# EAGLE design aaLogger (EAGLE 6.4)
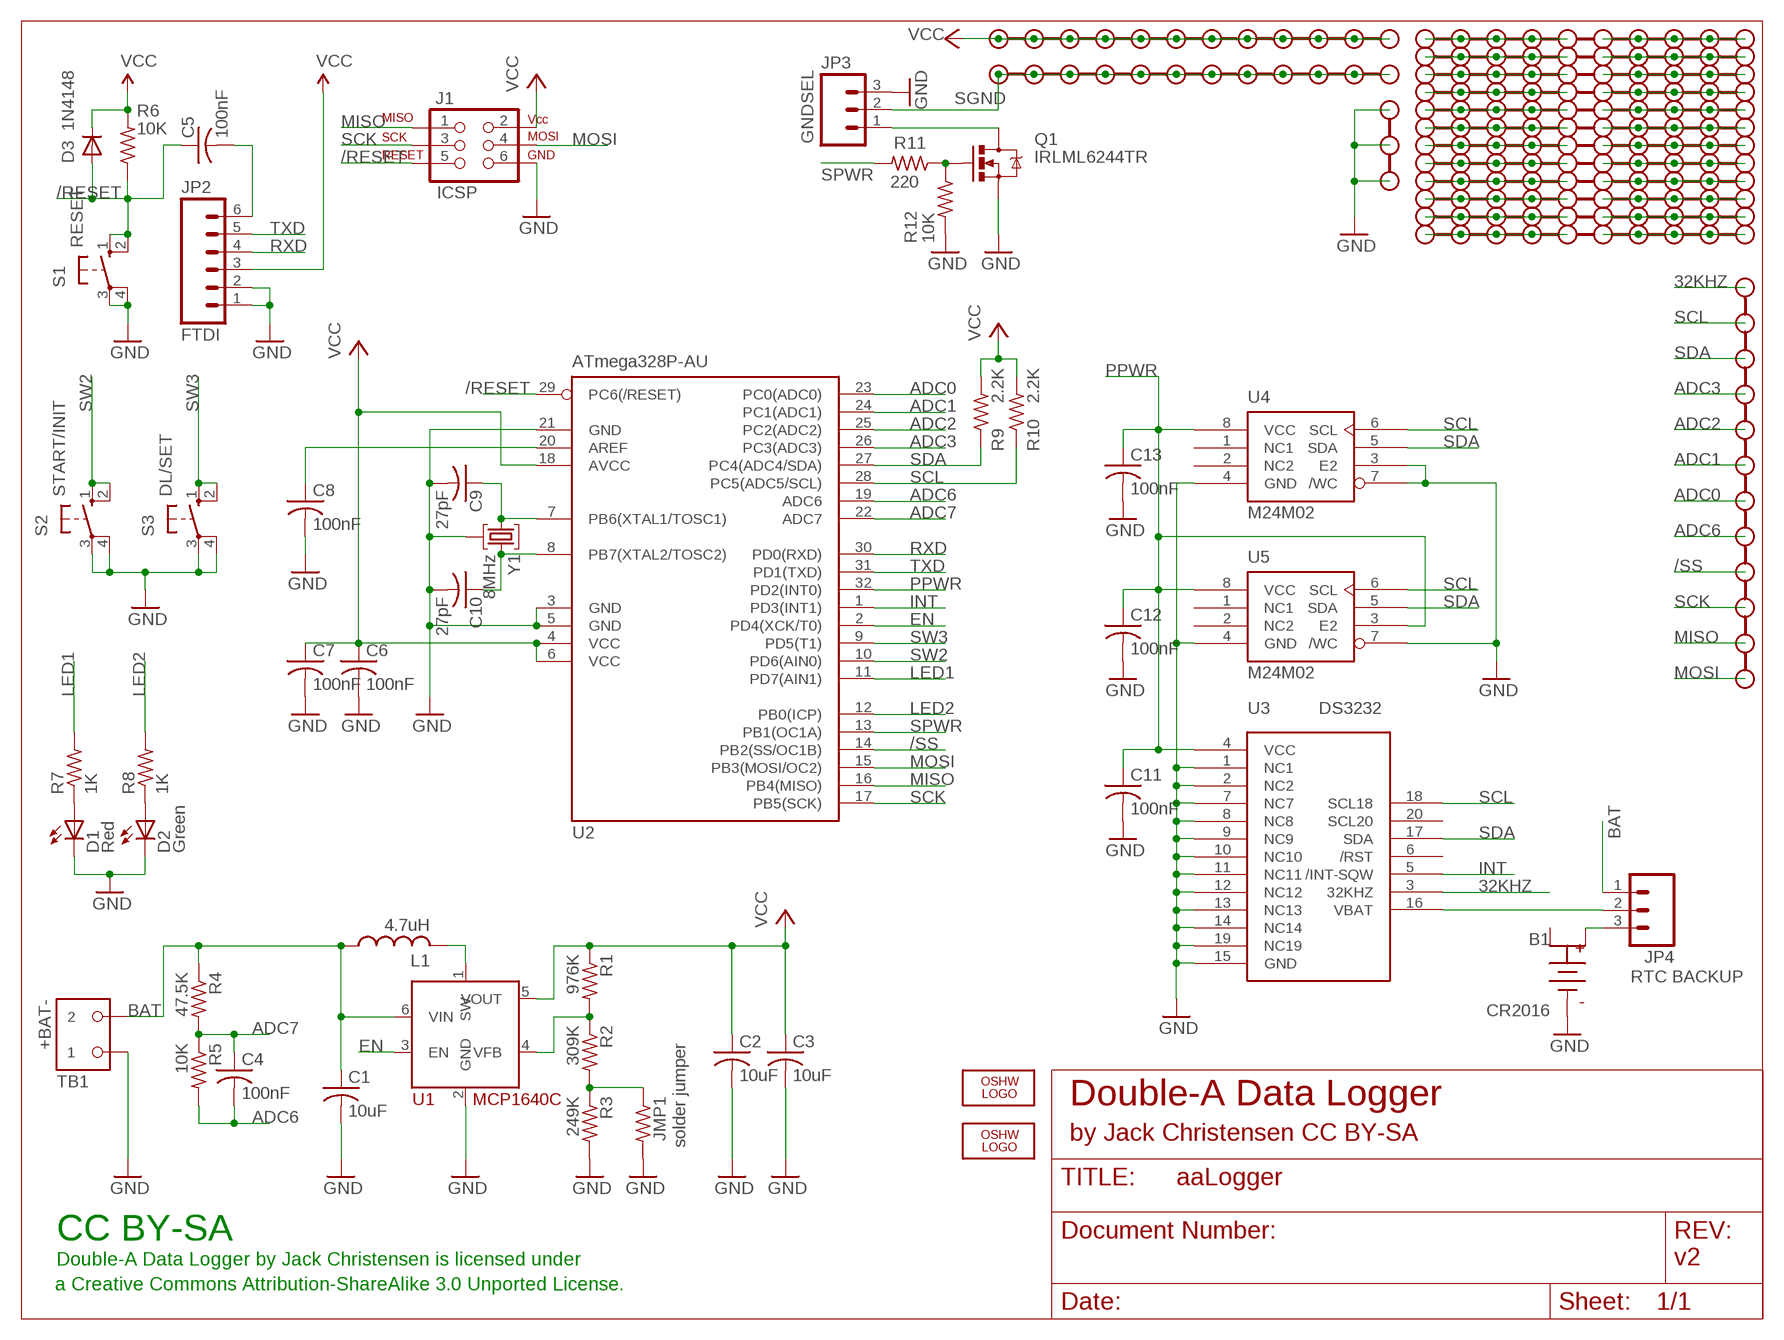
[diagram p0: schematic, sheet 1]

## Parts
B1  CR2016  COIN-CELL-2016-SMT  [BAT-HLD-002-SMT]
C1  10uF  C-USM0805  [M0805]
C2  10uF  C-USM0805  [M0805]
C3  10uF  C-USM0805  [M0805]
C4  100nF  C-USM0805  [M0805]
C5  100nF  C-USM0805  [M0805]
C6  100nF  C-USM0805  [M0805]
C7  100nF  C-USM0805  [M0805]
C8  100nF  C-USM0805  [M0805]
C9  27pF  C-USM0805  [M0805]
C10  27pF  C-USM0805  [M0805]
C11  100nF  C-USM0805  [M0805]
C12  100nF  C-USM0805  [M0805]
C13  100nF  C-USM0805  [M0805]
D1  Red  LEDCHIPLED_1206  [CHIPLED_1206]
D2  Green  LEDCHIPLED_1206  [CHIPLED_1206]
D3  1N4148  DIODESOD-323F  [SOD-323F]
J1  ICSP  AVR_SPI_PRG_62X3_LOCK  [2X3_LOCK]
JMP1  solder jumper  R-US_M0805  [M0805]
JP1  PROTO-12NR  [PROTO-12-NR]
JP2  FTDI  M06LOCK  [1X06_LOCK]
JP3  GNDSEL  M03LOCK  [1X03_LOCK]
JP4  RTC BACKUP  M03LOCK  [1X03_LOCK]
L1  4.7uH  INDUCTORNRS5020  [NRS5020]
LOGO1  OSHW_LOGO_8MILX0150-NT  [OSHW_8X150_NOTEXT]
LOGO2  OSHW_LOGO_8MILX0150-NT  [OSHW_8X150_NOTEXT]
PR1  PROTO-10  [PROTO-10]
PR2  PROTO-10  [PROTO-10]
PR3  PROTO-10  [PROTO-10]
PR4  PROTO-10  [PROTO-10]
PR5  PROTO-10  [PROTO-10]
PR6  PROTO-10  [PROTO-10]
PR7  PROTO-10  [PROTO-10]
PR8  PROTO-10  [PROTO-10]
PR9  PROTO-10  [PROTO-10]
PR10  PROTO-10  [PROTO-10]
PR11  PROTO-10  [PROTO-10]
PR12  PROTO-10  [PROTO-10]
PR13  PROTO-3  [PROTO-3]
Q1  IRLML6244TR  MOSFET-NCHANNELSOT23  [SOT23]
R1  976K  R-US_M0805  [M0805]
R2  309K  R-US_M0805  [M0805]
R3  249K  R-US_M0805  [M0805]
R4  47.5K  R-US_M0805  [M0805]
R5  10K  R-US_M0805  [M0805]
R6  10K  R-US_M0805  [M0805]
R7  1K  R-US_M0805  [M0805]
R8  1K  R-US_M0805  [M0805]
R9  2.2K  R-US_M0805  [M0805]
R10  2.2K  R-US_M0805  [M0805]
R11  220  R-US_M0805  [M0805]
R12  10K  R-US_M0805  [M0805]
S1  RESET  10-XXOCT  [B3F-10XXOCT]
S2  START/INIT  10-XXOCT  [B3F-10XXOCT]
S3  DL/SET  10-XXOCT  [B3F-10XXOCT]
TB1  +BAT-  OST-TB-23.5MM  [OST-TB-2-3.5MM]
U1  MCP1640C  MCP1640  [SOT23-6]
U2  ATmega328P-AU  MEGA8-AI  [TQFP32-08]
U3  DS3232  [SO20W]
U4  M24M02  [SO08]
U5  M24M02  [SO08]
U$1  PROTO-12PROTO  [PROTO-12]
U$2  PROTO-12PROTO  [PROTO-12]
Y1  8MHz  RESONATOR  [RESONATOR]

## Nets
32KHZ: JP1.1 U3.3(32KHZ)
/RESET: C5.1 D3.A J1.5 R6.1 S1.1(S) S1.2(S1) U2.29(PC6(/RESET))
/SS: JP1.9 U2.14(PB2(SS/OC1B))
ADC0: JP1.7 U2.23(PC0(ADC0))
ADC1: JP1.6 U2.24(PC1(ADC1))
ADC2: JP1.5 U2.25(PC2(ADC2))
ADC3: JP1.4 U2.26(PC3(ADC3))
ADC6: C4.2 JP1.8 R5.2 U2.19(ADC6)
ADC7: C4.1 R4.2 R5.1 U2.22(ADC7)
BAT: C1.1 JP4.1 L1.P$1 R4.1 TB1.P$2 U1.6(VIN)
EN: U1.3(EN) U2.2(PD4(XCK/T0))
GND: B1.NEG(B-) C1.2 C2.2 C3.2 C6.2 C7.2 C8.2 C9.2 C10.2 C11.2 C12.2 C13.2 D1.C D2.C J1.6 JMP1.2 JP2.1 JP2.2 JP3.3 PR13.1 PR13.2 PR13.3 Q1.2(S) R3.2 R12.2 S1.3(P) S1.4(P1) S2.3(P) S2.4(P1) S3.3(P) S3.4(P1) TB1.P$1 U1.2(GND) U2.3(GND) U2.5(GND) U2.21(GND) U3.1(NC1) U3.2(NC2) U3.7(NC7) U3.8(NC8) U3.9(NC9) U3.10(NC10) U3.11(NC11) U3.12(NC12) U3.13(NC13) U3.14(NC14) U3.15(GND) U3.19(NC19) U4.3(E2) U4.4(GND) U4.7(/WC) U5.4(GND) U5.7(/WC) Y1.2
INT: U2.1(PD3(INT1)) U3.5(/INT-SQW)
LED1: R7.2 U2.11(PD7(AIN1))
LED2: R8.2 U2.12(PB0(ICP))
MISO: J1.1 JP1.11 U2.16(PB4(MISO))
MOSI: J1.4 JP1.12 U2.15(PB3(MOSI/OC2))
N$1: B1.POS1 JP4.3
N$2: D1.A R7.1
N$3: D2.A R8.1
N$4: PR1.6 PR1.7 PR1.8 PR1.9 PR1.10
N$5: PR5.6 PR5.7 PR5.8 PR5.9 PR5.10
N$6: R1.2 R2.1 U1.4(VFB)
N$7: L1.P$2 U1.1(SW)
N$8: C9.1 U2.7(PB6(XTAL1/TOSC1)) Y1.1
N$9: PR2.6 PR2.7 PR2.8 PR2.9 PR2.10
N$10: PR3.6 PR3.7 PR3.8 PR3.9 PR3.10
N$11: C10.1 U2.8(PB7(XTAL2/TOSC2)) Y1.3
N$12: JMP1.1 R2.2 R3.1
N$13: C8.1 U2.20(AREF)
N$14: PR4.6 PR4.7 PR4.8 PR4.9 PR4.10
N$15: PR6.6 PR6.7 PR6.8 PR6.9 PR6.10
N$16: PR7.1 PR7.2 PR7.3 PR7.4 PR7.5
N$17: PR8.1 PR8.2 PR8.3 PR8.4 PR8.5
N$18: PR9.1 PR9.2 PR9.3 PR9.4 PR9.5
N$19: PR10.1 PR10.2 PR10.3 PR10.4 PR10.5
N$20: PR11.1 PR11.2 PR11.3 PR11.4 PR11.5
N$21: PR12.1 PR12.2 PR12.3 PR12.4 PR12.5
N$22: PR1.1 PR1.2 PR1.3 PR1.4 PR1.5
N$23: PR2.1 PR2.2 PR2.3 PR2.4 PR2.5
N$24: Q1.1(G) R11.1 R12.1
N$25: PR3.1 PR3.2 PR3.3 PR3.4 PR3.5
N$26: PR4.1 PR4.2 PR4.3 PR4.4 PR4.5
N$27: PR6.1 PR6.2 PR6.3 PR6.4 PR6.5
N$28: PR7.6 PR7.7 PR7.8 PR7.9 PR7.10
N$29: PR5.1 PR5.2 PR5.3 PR5.4 PR5.5
N$30: PR8.6 PR8.7 PR8.8 PR8.9 PR8.10
N$31: PR9.6 PR9.7 PR9.8 PR9.9 PR9.10
N$32: PR10.6 PR10.7 PR10.8 PR10.9 PR10.10
N$33: PR11.6 PR11.7 PR11.8 PR11.9 PR11.10
N$34: PR12.6 PR12.7 PR12.8 PR12.9 PR12.10
N$35: JP4.2 U3.16(VBAT)
N$36: JP3.1 Q1.3(D)
PPWR: C11.1 C12.1 C13.1 U2.32(PD2(INT0)) U3.4(VCC) U4.8(VCC) U5.3(E2) U5.8(VCC)
RST: C5.2 JP2.6
RXD: JP2.4 U2.30(PD0(RXD))
SCK: J1.3 JP1.10 U2.17(PB5(SCK))
SCL: JP1.2 R10.1 U2.28(PC5(ADC5/SCL)) U3.18(SCL18) U4.6(SCL) U5.6(SCL)
SDA: JP1.3 R9.1 U2.27(PC4(ADC4/SDA)) U3.17(SDA) U4.5(SDA) U5.5(SDA)
SGND: JP3.2 U$2.1 U$2.2 U$2.3 U$2.4 U$2.5 U$2.6 U$2.7 U$2.8 U$2.9 U$2.10 U$2.11 U$2.12
SPWR: R11.2 U2.13(PB1(OC1A))
SW2: S2.1(S) S2.2(S1) U2.10(PD6(AIN0))
SW3: S3.1(S) S3.2(S1) U2.9(PD5(T1))
TXD: JP2.5 U2.31(PD1(TXD))
VCC: C2.1 C3.1 C6.1 C7.1 D3.K J1.2 JP2.3 R1.1 R6.2 R9.2 R10.2 U1.5(VOUT) U2.4(VCC) U2.6(VCC) U2.18(AVCC) U$1.1 U$1.2 U$1.3 U$1.4 U$1.5 U$1.6 U$1.7 U$1.8 U$1.9 U$1.10 U$1.11 U$1.12
Unconnected: B1.POS2 U3.6(/RST) U3.20(SCL20) U4.1(NC1) U4.2(NC2) U5.1(NC1) U5.2(NC2)

## Notes on the sheet
- Double-A Data Logger
- by Jack Christensen CC BY-SA
- CC BY-SA
- Double-A Data Logger by Jack Christensen is licensed under | v2
- a Creative Commons Attribution-ShareAlike 3.0 Unported License.

## Library data of the parts
B1 = _jc:COIN-CELL
C1-C13 = _jc:C-US: CAPACITOR, American symbol
D1 D2 = adafruit:LED: LED OSRAM: - CHIPLED LG R971, LG N971, LY N971, LG Q971, LY Q971, LO R971, LY R971 LH N974, LH R974 LS Q976, LO Q976, LY Q976 LO Q996 - Hyper CHIPLED LW Q18S LB Q993, LB Q99A, LB R99A - SideLED LS A670, LO A670, LY A670, LG A670, LP A670 LB A673, LV A673, LT A673, LW A673 LH A674 LY A675 LS A676, LA A676, LO A676, LY A676, LW A676 LS A679, LY A679, LG A679 - Hyper Micro SIDELED® LS Y876, LA Y876, LO Y876, LY Y876 LT Y87S - SmartLED LW L88C, LW L88S LB L89C, LB L89S, LG L890 LS L89K, LO L89K, LY L89K LS L896, LA L896, LO L896, LY L896 - TOPLED LS T670, LO T670, LY T670, LG T670, LP T670 LSG T670, LSP T670, LSY T670, LOP T670, LYG T670 LG T671, LOG T671, LSG T671 LB T673, LV T673, LT T673, LW T673 LH T674 LS T676, LA T676, LO T676, LY T676, LB T676, LH T676, LSB T676, LW T676 LB T67C, LV T67C, LT T67C, LS T67K, LO T67K, LY T67K, LW E67C LS E67B, LA E67B, LO E67B, LY E67B, LB E67C, LV E67C, LT E67C LW T67C LS T679, LY T679, LG T679 LS T770, LO T770, LY T770, LG T770, LP T770 LB T773, LV T773, LT T773, LW T773 LH T774 LS E675, LA E675, LY E675, LS T675 LS T776, LA T776, LO T776, LY T776, LB T776 LHGB T686 LT T68C, LB T68C - Hyper Mini TOPLED® LB M676 - Mini TOPLED Santana® LG M470 LS M47K, LO M47K, LY M47K Source: http://www.osram.convergy.de/
D3 = _jc:DIODE
J1 = _jc:AVR_SPI_PRG_6: AVR ISP 6 Pin This is the reduced ISP connector for AVR programming. Common on Arduino. This footprint will take up less PCB space and can be used with a 10-pin to 6-pin adapter such as SKU: BOB-08508
JMP1 R1-R12 = _jc:R-US_: RESISTOR, American symbol
JP1 U$1 U$2 = _jc:PROTO-12
JP2 = SparkFun:M06: Header 6 Standard 6-pin 0.1" header. Use with straight break away headers (SKU : PRT-00116), right angle break away headers (PRT-00553), swiss pins (PRT-00743), machine pins (PRT-00117), and female headers (PRT-00115). Molex polarized connector foot print use with SKU : PRT-08094 with associated crimp pins and housings. NOTES ON THE VARIANTS LOCK and LOCK_LONGPADS... This footprint was designed to help hold the alignment of a through-hole component (i.e. 6-pin header) while soldering it into place. You may notice that each hole has been shifted either up or down by 0.005 of an inch from it's more standard position (which is a perfectly straight line). This slight alteration caused the pins (the squares in the middle) to touch the edges of the holes. Because they are alternating, it causes a "brace" to hold the component in place. 0.005 has proven to be the perfect amount of "off-center" position when using our standard breakaway headers. Although looks a little odd when you look at the bare footprint, once you have a header in there, the alteration is very hard to notice. Also, if you push a header all the way into place, it is covered up entirely on the bottom side. This idea of altering the position of holes to aid alignment will be further integrated into the Sparkfun Library for other footprints. It can help hold any component with 3 or more connection pins.
JP3 JP4 = SparkFun:M03: Header 3 Standard 3-pin 0.1" header. Use with straight break away headers (SKU : PRT-00116), right angle break away headers (PRT-00553), swiss pins (PRT-00743), machine pins (PRT-00117), and female headers (PRT-00115). Molex polarized connector foot print use with SKU : PRT-08232 with associated crimp pins and housings.
L1 = _jc:INDUCTOR: Murata #11R472C
LOGO1 LOGO2 = ohw-logo:OSHW_LOGO_8MIL
PR1-PR12 = _jc:PROTO-10
PR13 = _jc:PROTO-3
Q1 = _jc:MOSFET-NCHANNEL
S1-S3 = _jc:10-XX: OMRON SWITCH
TB1 = _jc:OST-TB-2
U1 = _jc:MCP1640
U2 = atmel:MEGA8: MICROCONTROLLER 8 Kbytes FLASH, 1 kbytes SRAM, 512 bytes EEPROM, USART, 6-channel 10 bit ADC, 2-channel 8 bit ADC Pin compatible with Atmega48, ATMega88, ATMega168 Source: avr.lbr; MPN: ATMEGA8-16AU; OC_FARNELL: 9171371; OC_NEWARK: 73M8863
U3 = _jc:DS3232
U4 U5 = _jc:M24M02
Y1 = _jc:RESONATOR: Ceramic resonator with capacitors or HC49/US crystal

## Board
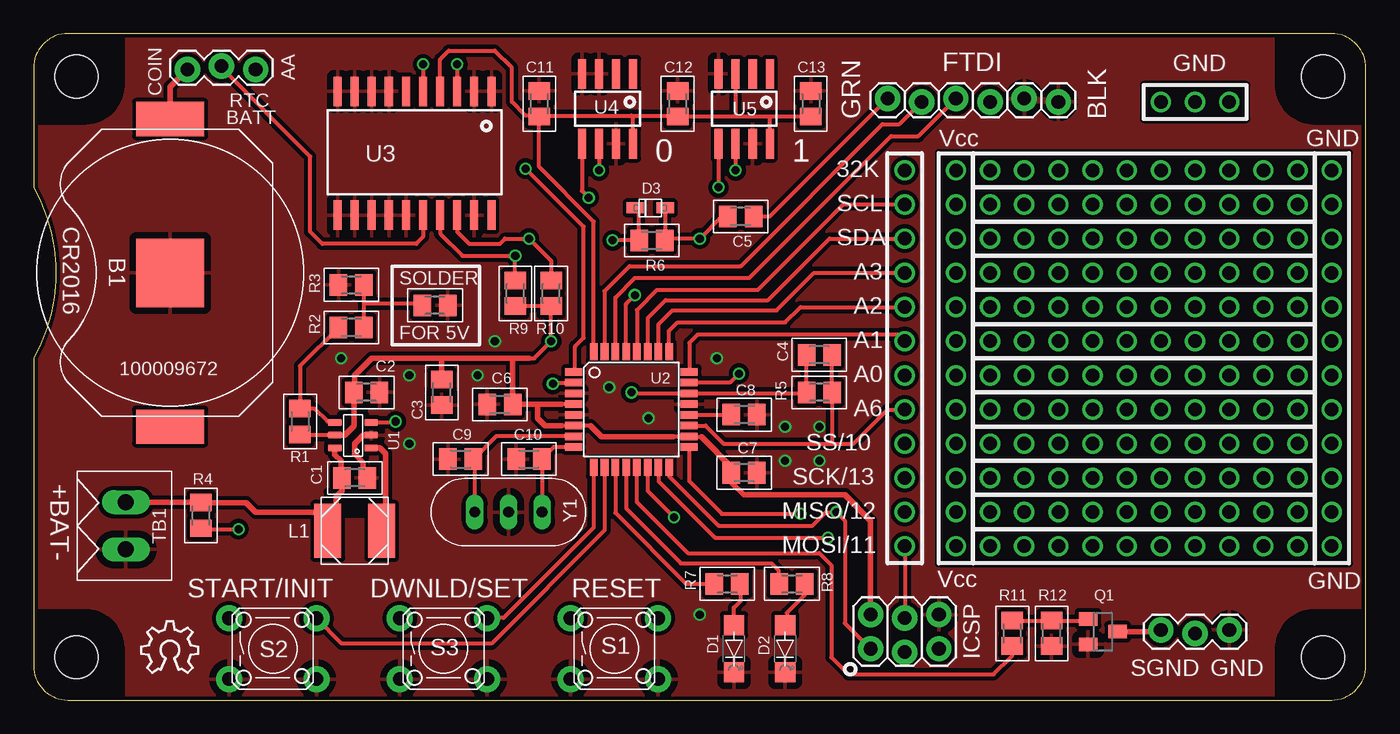
[diagram p1: board, top side]
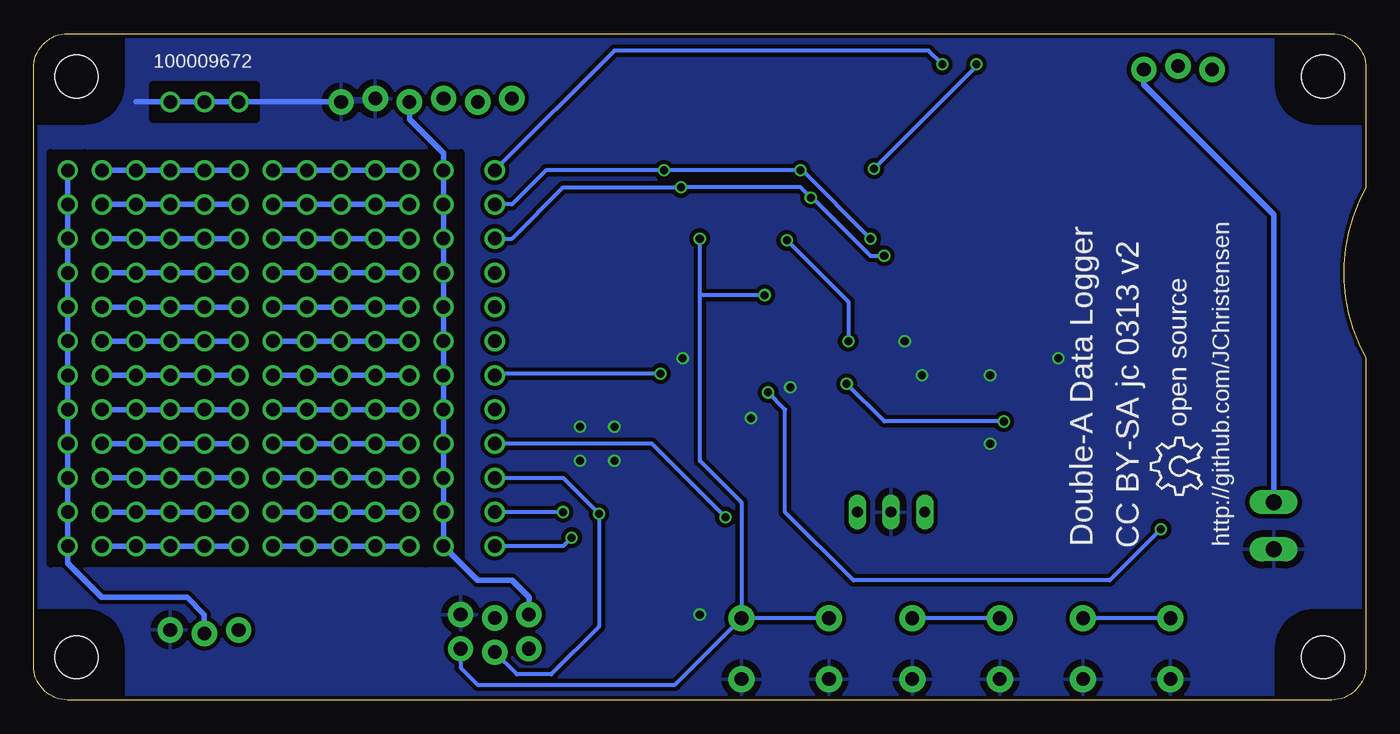
[diagram p2: board, bottom side, seen from below]

Size 99.06 x 49.53 mm. Coordinates in mm from the lower left corner, seen from the top.
Outline: 0,46.99 0,38.1 arc-58 0,25.4 0,2.54 arc90 2.54,0 96.52,0 arc90 99.06,2.54 99.06,46.99 arc90 96.52,49.53 2.54,49.53 arc90 0,46.99
Copper layers (1*16): Top 0.035mm / dielectric 1.5mm / Bottom 0.035mm
Design rules "ITead_rule_jc *": minimum track width 10mil, minimum drill 12mil, track to track 10mil, track to pad 9mil, pad to pad 9mil, via to via 10mil, smd to smd 0mil, copper to edge 10mil, drill to drill 10mil, minimum pad ring 10mil, minimum via ring 6mil, stop-mask expansion 2mil, vias tented up to drill 100mil, thermal gap 20mil
Holes 3.2 mm at 3.17,46.35 3.17,3.17 95.89,46.35 95.89,3.17
tRestrict: area 0,43.2 to 6.3,49.5; area 92.7,43.2 to 99.1,49.5; area 0,0 to 6.3,6.3; area 92.7,0 to 99.1,6.3; area 21.8,13.8 to 25.7,15.5; area 22.9,17.3 to 24.6,21.2
bRestrict: area 0,0 to 6.3,6.3; area 92.7,0 to 99.1,6.3; area 92.7,43.2 to 99.1,49.5; area 0,43.2 to 6.3,49.5

### Footprints (pad centres in the part's own frame; a part is rotated, then mirrored left to right if it is on the bottom)
BAT-HLD-002-SMT = smd 5.08 x 5.08: NEG 0,0 | smd 2.54 x 5.08: POS1 -11.43,0; POS2 11.43,0
M0805 = smd 1.3 x 1.6: 1 -0.95,0; 2 0.95,0
CHIPLED_1206 = smd 1.5 x 1.5: A 0,-1.75; C 0,1.75
SOD-323F = smd 1.27 x 0.813: A -1.118,0; K 1.118,0
2X3_LOCK = drill 1.016 pad 1.88: 1 0,0; 2 0,2.54; 3 2.54,-0.254; 4 2.54,2.286; 5 5.08,0; 6 5.08,2.54
PROTO-12-NR = drill 1: 1 -13.97,0; 2 -11.43,0; 3 -8.89,0; 4 -6.35,0; 5 -3.81,0; 6 -1.27,0; 7 1.27,0; 8 3.81,0; 9 6.35,0; 10 8.89,0; 11 11.43,0; 12 13.97,0
1X06_LOCK = drill 1.016 pad 1.88: 1 0,0; 2 2.54,-0.254; 3 5.08,0; 4 7.62,-0.254; 5 10.16,0; 6 12.7,-0.254
1X03_LOCK = drill 1.016 pad 1.88: 1 0,0.127; 2 2.54,-0.127; 3 5.08,0.127
NRS5020 = smd 2 x 4: P$1 -2,0; P$2 2,0
PROTO-10 = drill 1: 1 -11.43,0; 2 -8.89,0; 3 -6.35,0; 4 -3.81,0; 5 -1.27,0; 6 1.27,0; 7 3.81,0; 8 6.35,0; 9 8.89,0; 10 11.43,0
PROTO-3 = drill 1: 1 -2.54,0; 2 0,0; 3 2.54,0
SOT23 = smd 1 x 1.4: 1 -0.95,-1.1; 2 0.95,-1.1; 3 0,1.1
B3F-10XXOCT = drill 1.016 pad 1.93: 1 -3.251,2.261; 2 3.251,2.261; 3 -3.251,-2.261; 4 3.251,-2.261
OST-TB-2-3.5MM = drill 1.2 long: P$1 1.75,0; P$2 -1.75,0
SOT23-6 = smd 0.508 x 1.016: 1 -0.95,-1.35; 2 0,-1.35; 3 0.95,-1.35; 4 0.95,1.35; 5 0,1.35; 6 -0.95,1.35
TQFP32-08 = smd 1.27 x 0.559: 1 -4.293,2.8; 2 -4.293,2; 3 -4.293,1.2; 4 -4.293,0.4; 5 -4.293,-0.4; 6 -4.293,-1.2; 7 -4.293,-2; 8 -4.293,-2.8; 17 4.293,-2.8; 18 4.293,-2; 19 4.293,-1.2; 20 4.293,-0.4; 21 4.293,0.4; 22 4.293,1.2; 23 4.293,2; 24 4.293,2.8 | smd 0.559 x 1.27: 9 -2.8,-4.293; 10 -2,-4.293; 11 -1.2,-4.293; 12 -0.4,-4.293; 13 0.4,-4.293; 14 1.2,-4.293; 15 2,-4.293; 16 2.8,-4.293; 25 2.8,4.293; 26 2,4.293; 27 1.2,4.293; 28 0.4,4.293; 29 -0.4,4.293; 30 -1.2,4.293; 31 -2,4.293; 32 -2.8,4.293
SO20W = smd 0.6 x 2.2: 1 -5.715,-4.6; 2 -4.445,-4.6; 3 -3.175,-4.6; 4 -1.905,-4.6; 5 -0.635,-4.6; 6 0.635,-4.6; 7 1.905,-4.6; 8 3.175,-4.6; 9 4.445,-4.6; 10 5.715,-4.6; 11 5.715,4.6; 12 4.445,4.6; 13 3.175,4.6; 14 1.905,4.6; 15 0.635,4.6; 16 -0.635,4.6; 17 -1.905,4.6; 18 -3.175,4.6; 19 -4.445,4.6; 20 -5.715,4.6
SO08 = smd 0.6 x 2.2: 1 -1.905,-2.6; 2 -0.635,-2.6; 3 0.635,-2.6; 4 1.905,-2.6; 5 1.905,2.6; 6 0.635,2.6; 7 -0.635,2.6; 8 -1.905,2.6
PROTO-12 = drill 1: 1 -13.97,0; 2 -11.43,0; 3 -8.89,0; 4 -6.35,0; 5 -3.81,0; 6 -1.27,0; 7 1.27,0; 8 3.81,0; 9 6.35,0; 10 8.89,0; 11 11.43,0; 12 13.97,0
RESONATOR = drill 0.8 pad 1.27 long: 1 -2.5,0; 2 0,0; 3 2.5,0

### Placement (x,y rotation side)
B1  10.16,31.75 270 top
C1  23.88,16.51 0 top
C2  24.77,22.86 0 top
C3  30.35,22.86 270 top
C4  58.42,25.65 0 top
C5  52.58,35.94 0 top
C6  34.67,21.97 180 top
C7  52.83,16.89 0 top
C8  52.83,21.21 0 top
C9  31.75,17.91 180 top
C10  36.83,17.91 180 top
C11  37.59,44.32 90 top
C12  47.88,44.32 90 top
C13  57.78,44.32 90 top
D1  52.07,3.81 180 top
D2  55.88,3.81 180 top
D3  45.85,36.58 180 top
J1  62.23,3.81 0 top
JMP1  29.84,29.34 0 top
JP1  64.77,25.4 270 top
JP2  76.2,44.45 180 top
JP3  83.82,5.08 0 top
JP4  16.51,46.99 180 top
L1  23.88,12.57 0 top
LOGO1  8,2.03 0 top
LOGO2  12.19,15.24 90 bottom
PR1  82.55,39.37 0 top
PR2  82.55,36.83 0 top
PR3  82.55,34.29 0 top
PR4  82.55,31.75 0 top
PR5  82.55,29.21 0 top
PR6  82.55,26.67 0 top
PR7  82.55,24.13 0 top
PR8  82.55,21.59 0 top
PR9  82.55,19.05 0 top
PR10  82.55,16.51 0 top
PR11  82.55,13.97 0 top
PR12  82.55,11.43 0 top
PR13  86.36,44.45 0 top
Q1  79.5,5.08 270 top
R1  19.81,20.7 90 top
R2  23.62,27.69 0 top
R3  23.62,30.86 180 top
R4  12.45,13.72 270 top
R5  58.42,22.86 0 top
R6  45.97,34.16 180 top
R7  51.56,8.64 180 top
R8  56.39,8.64 180 top
R9  35.81,30.23 270 top
R10  38.48,30.23 270 top
R11  72.77,4.95 270 top
R12  75.69,4.95 270 top
S1  43.18,3.81 0 top
S2  17.78,3.81 0 top
S3  30.48,3.81 0 top
TB1  6.86,12.95 270 top
U1  23.75,19.68 90 top
U2  44.45,21.59 0 top
U3  28.32,40.64 180 top
U4  42.67,43.94 180 top
U5  52.83,43.94 180 top
U$1  68.58,25.4 270 top
U$2  96.52,25.4 270 top
Y1  35.31,13.97 0 top

### Tracks (layer width: path | path; a pad name or v marks a point on that pad's centre or on a via)
32KHZ  (via drill 0.6)
  Top 0.305: v31.5,47.24 U3.3
  Bottom 0.305: v31.5,47.24 32.51,48.26 55.88,48.26 JP1.1
/RESET  (via drill 0.6)
  Top 0.305: D3.A 46.97,34.3 R6.1 46.95,34.29 v49.53,34.29 51.18,35.94 C5.1 | v44.7,30.1 44.05,29.45 U2.29
  Bottom 0.305: S1.1 S1.2 | v44.7,30.1 49.53,30.1 | 49.53,30.1 v49.53,34.29 | 49.53,30.1 49.53,17.78 46.43,14.68 S1.2 | J1.5 67.31,2.41 66.04,1.14 51.36,1.14 S1.2
/SS  (via drill 0.6)
  Top 0.305: U2.14 45.65,15.56 v47.62,13.59
  Bottom 0.305: v47.62,13.59 53.09,19.05 JP1.9
ADC0  (via drill 0.6)
  Top 0.305: U2.23 48.77,23.62 51.82,23.62 v52.45,24.26
  Bottom 0.305: v52.45,24.26 64.64,24.26 JP1.7
ADC1
  Top 0.305: JP1.6 64.26,27.18 49.4,27.18 48.77,26.54 48.77,24.41 U2.24
ADC2
  Top 0.305: U2.25 47.24,27.43 47.88,28.07 55.88,28.07 57.02,29.21 JP1.5
ADC3
  Top 0.305: U2.26 46.48,25.91 46.48,27.94 47.5,28.96 55.24,28.96 58.04,31.75 JP1.4
ADC6
  Top 0.305: U2.19 49.97,20.39 51.31,19.05 59.31,19.05 | 59.31,19.05 60.96,19.05 63.5,21.59 JP1.8 | C4.2 R5.2 59.37,19.11 59.31,19.05
ADC7  (via drill 0.6)
  Top 0.305: C4.1 R5.1 57.4,22.79 U2.22 44.52,22.79 v44.45,22.86 | R4.2 12.51,12.7 v15.24,12.7
  Bottom 0.305: v44.45,22.86 43.18,21.59 43.18,13.97 38.1,8.89 19.05,8.89 v15.24,12.7
BAT
  Top 0.406: U1.6 22.4,18.24 22.86,17.78 22.86,16.58 C1.1 22.93,15.56 22.48,15.11 22.48,13.18 L1.P$1 21.59,12.86 21.59,13.97 16.51,13.97 15.81,14.67 R4.1 12.45,14.7 TB1.P$2
  Bottom 0.406: JP4.1 16.51,45.72 6.86,36.07 TB1.P$2
EN  (via drill 0.6)
  Top 0.305: U1.3 26.86,20.64 v26.92,20.7 | v38.61,23.5 38.7,23.59 U2.2
  Bottom 0.305: v26.92,20.7 35.81,20.7 v38.61,23.5
GND  (via drill 0.6)
  Top 0.406: U1.2 24.51,19.68 23.88,19.05 23.88,18.29 24.51,17.65 24.51,17.02 24.83,16.7 C1.2
  Bottom 0.406: JP2.1 PR13.1 PR13.2 PR13.3 91.44,44.45
  other vias: 58.42,20.32 55.88,17.78 45.72,20.95 42.8,23.24 49.53,6.35 22.86,25.4 34.29,26.67 27.94,24.13 27.94,19.05 33.02,24.13 55.88,20.32 58.42,17.78 50.8,25.4
  pour Top (isolate 0.305): -2.54,52.07 101.6,52.07 101.6,-2.54 -2.54,-2.54
  pour Bottom (isolate 0.305): -1.27,50.8 -1.27,-1.27 100.33,-1.27 100.33,50.8
INT  (via drill 0.6)
  Top 0.305: U2.1 40.26,24.49 40.26,26.29 40.89,26.92 40.89,35.18 v36.58,39.5 | v28.96,47.24 U3.5
  Bottom 0.305: v36.58,39.5 28.96,47.12 v28.96,47.24
LED1
  Top 0.305: U2.11 43.25,13.9 48.51,8.64 R7.2
LED2
  Top 0.305: R8.2 55.37,8.7 55.37,9.65 54.86,10.16 48.13,10.16 44.05,14.24 U2.12
MISO  (via drill 0.6)
  Top 0.305: U2.16 47.25,16.63 50.93,12.95 57.91,12.95 58.93,13.97 v59.69,13.97 60.33,13.34 60.33,5.71 J1.1
  Bottom 0.305: v59.69,13.97 JP1.11
MOSI  (via drill 0.6)
  Top 0.305: U2.15 46.48,17.27 46.48,16.26 50.67,12.06 v59.05,12.06 | JP1.12 J1.4
  Bottom 0.305: v59.05,12.06 59.69,11.43 JP1.12
N$1
  Top 0.406: B1.POS1 10.16,45.59 JP4.3
N$2
  Top 0.305: D1.A 52.07,6.86 52.58,7.37 52.58,8.57 R7.1
N$3
  Top 0.305: R8.1 57.34,7.81 56.01,6.48 56.01,5.69 D2.A
N$4
  Bottom 0.406: PR1.6 PR1.7 PR1.8 PR1.9 PR1.10
N$5
  Bottom 0.406: PR5.6 PR5.7 PR5.8 PR5.9 PR5.10
N$6
  Top 0.305: U1.4 22.33,20.7 21.84,20.7 20.89,21.65 R1.2 19.81,24.83 R2.1
N$7
  Top 0.406: U1.1 25.71,18.73 26.16,18.29 26.16,12.86 L1.P$2
N$8
  Top 0.305: Y1.1 32.81,17.78 C9.1 34.38,19.59 U2.7
N$9
  Bottom 0.406: PR2.6 PR2.7 PR2.8 PR2.9 PR2.10
N$10
  Bottom 0.406: PR3.10 PR3.9 PR3.8 PR3.7 PR3.6
N$11
  Top 0.305: Y1.3 37.81,17.78 C10.1 38.66,18.79 U2.8
N$12
  Top 0.305: R2.2 24.57,29.46 | 24.57,29.46 R3.1 | JMP1.1 28.77,29.46 24.57,29.46
N$13
  Top 0.305: U2.20 51.88,21.19 C8.1
N$14
  Bottom 0.406: PR4.6 PR4.7 PR4.8 PR4.9 PR4.10
N$15
  Bottom 0.406: PR6.10 PR6.9 PR6.8 PR6.7 PR6.6
N$16
  Bottom 0.406: PR7.1 PR7.2 PR7.3 PR7.4 PR7.5
N$17
  Bottom 0.406: PR8.5 PR8.4 PR8.3 PR8.2 PR8.1
N$18
  Bottom 0.406: PR9.1 PR9.2 PR9.3 PR9.4 PR9.5
N$19
  Bottom 0.406: PR10.5 PR10.4 PR10.3 PR10.2 PR10.1
N$20
  Bottom 0.406: PR11.1 PR11.2 PR11.3 PR11.4 PR11.5
N$21
  Bottom 0.406: PR12.5 PR12.4 PR12.3 PR12.2 PR12.1
N$22
  Bottom 0.406: PR1.1 PR1.2 PR1.3 PR1.4 PR1.5
N$23
  Bottom 0.406: PR2.1 PR2.2 PR2.3 PR2.4 PR2.5
N$24
  Top 0.305: R11.1 R12.1 78.28,5.9 Q1.1
N$25
  Bottom 0.406: PR3.5 PR3.4 PR3.3 PR3.2 PR3.1
N$26
  Bottom 0.406: PR4.1 PR4.2 PR4.3 PR4.4 PR4.5
N$27
  Bottom 0.406: PR6.5 PR6.4 PR6.3 PR6.2 PR6.1
N$28
  Bottom 0.406: PR7.6 PR7.7 PR7.8 PR7.9 PR7.10
N$29
  Bottom 0.406: PR5.1 PR5.2 PR5.3 PR5.4 PR5.5
N$30
  Bottom 0.406: PR8.10 PR8.9 PR8.8 PR8.7 PR8.6
N$31
  Bottom 0.406: PR9.6 PR9.7 PR9.8 PR9.9 PR9.10
N$32
  Bottom 0.406: PR10.10 PR10.9 PR10.8 PR10.7 PR10.6
N$33
  Bottom 0.406: PR11.6 PR11.7 PR11.8 PR11.9 PR11.10
N$34
  Bottom 0.406: PR12.10 PR12.9 PR12.8 PR12.7 PR12.6
N$35
  Top 0.305: U3.16 28.96,34.42 28.45,33.91 21.46,33.91 20.57,34.8 20.57,40.39 13.97,46.99 JP4.2
N$36
  Top 0.406: Q1.3 83.69,5.08 JP3.1
PPWR
  Top 0.305: U2.32 41.65,35.57 37.59,39.62 C11.1 37.55,43.43 | 37.55,43.43 44.45,43.43 | 44.45,43.43 47.82,43.43 C12.1 52.2,43.37 | 52.2,43.37 54.61,43.37 | 54.61,43.37 C13.1 | U4.8 44.58,43.31 44.45,43.43 | U5.8 54.74,43.25 54.61,43.37 | 37.55,43.43 36.58,43.43 35.56,44.45 35.56,46.99 34.29,48.26 30.86,48.26 30.23,47.62 U3.4 | U5.3 52.2,43.37
RST
  Top 0.305: C5.2 54.74,35.94 JP2.6
RXD
  Top 0.305: U2.30 43.25,29.91 44.7,31.37 53.21,31.37 63.75,41.91 65.79,41.91 JP2.4
SCK  (via drill 0.6)
  Top 0.305: v57.02,13.84 51.18,13.84 48.74,16.28 U2.17
  Bottom 0.305: J1.3 63.12,1.91 60.58,1.91 57.02,5.46 v57.02,13.84 59.69,16.51 JP1.10
SCL  (via drill 0.6)
  Top 0.305: 44.96,25.99 U2.28 44.85,28.98 46.35,30.48 53.85,30.48 60.2,36.83 JP1.2 | U5.6 v52.2,39.37 | U4.6 v42.04,39.37 | U3.18 31.5,34.8 32.38,33.91 34.67,33.91 35.05,34.29 v36.83,34.29 38.48,32.64 R10.1
  Bottom 0.305: JP1.2 63.5,36.83 60.96,39.37 v52.2,39.37 v42.04,39.37 41.91,39.37 v36.83,34.29
SDA  (via drill 0.6)
  Top 0.305: 45.72,25.95 U2.27 45.65,28.38 46.99,29.72 54.61,29.72 59.18,34.29 JP1.3 | U5.5 v50.93,38.1 | U4.5 40.77,37.85 v41.27,37.34 | U3.17 30.23,34.67 31.88,33.02 v35.81,33.02 R9.1
  Bottom 0.305: JP1.3 63.5,34.29 59.69,38.1 v50.93,38.1 42.04,38.1 v41.27,37.34 41.15,37.34 36.83,33.02 v35.81,33.02
SGND
  Bottom 0.406: U$2.1 U$2.2 U$2.3 U$2.4 U$2.5 U$2.6 U$2.7 U$2.8 U$2.9 U$2.10 U$2.11 U$2.12 96.52,10.16 93.98,7.62 87.63,7.62 86.36,6.35 JP3.2
SPWR
  Top 0.305: U2.13 44.83,17.28 44.83,14.73 48.64,10.92 58.42,10.92 59.31,10.03 59.31,3.17 60.58,1.91 71.37,1.91 72.77,3.3 R11.2
SW2
  Top 0.305: U2.10 42.45,12.61 34.04,4.19 22.91,4.19 S2.2
  Bottom 0.305: S2.1 S2.2
SW3
  Top 0.305: U2.9 41.65,12.82 34.92,6.1 33.76,6.1 S3.2
  Bottom 0.305: S3.1 S3.2
TXD
  Top 0.305: 42.55,25.98 U2.31 42.45,30.39 44.32,32.26 52.58,32.26 63.12,42.8 64.39,42.8 JP2.5
VCC  (via drill 0.6)
  Top 0.305: 51.98,17.11 C7.1 51.98,17.23 | 40.21,20.45 U2.6 41.4,20.4 | 49.66,19.56 48.77,19.56 U2.18 47.52,19.58 | U2.4 39.13,21.99 39.24,21.97 | U1.5 20.45,19.68 20.38,19.75 R1.1 | 40.09,20.32 39.96,20.42 39.94,20.4 39.27,20.4 | D3.K 45.02,36.28 R6.2 v43.05,34.16 | 35.56,29.02 R9.2 R10.2 v38.48,26.67 37.21,25.4 36.83,25.4
  Top 0.406: U2.6 40.09,20.32 | 39.24,21.97 37.47,21.97 | 49.66,19.56 51.98,17.23 | J1.2 62.23,13.34 60.33,15.24 52.83,15.24 51.98,16.09 C7.1 | 37.47,21.97 C6.1 35.62,25.34 35.56,25.4 | 37.47,21.97 37.47,20.95 38.02,20.4 39.27,20.4 | U1.5 23.11,19.68 23.82,20.39 C2.1 23.88,22.92 23.88,24.13 25.15,25.4 30.35,25.4 | 30.35,25.4 35.56,25.4 | C3.1 30.35,25.4 | 47.52,19.58 42.22,19.58 41.4,20.4 | 35.56,25.4 36.83,25.4
  Bottom 0.305: v43.05,34.16 38.48,29.59 v38.48,26.67
  Bottom 0.406: J1.2 62.23,7.62 63.5,8.89 66.04,8.89 U$1.12 U$1.11 U$1.10 U$1.9 U$1.8 U$1.7 U$1.6 U$1.5 U$1.4 U$1.3 U$1.2 U$1.1 68.58,40.64 71.12,43.18 JP2.3

### Text on the board
tPlace: COIN | AA | FTDI | GND | RTC | BATT | GRN | BLK | Vcc | GND | 0 | 1 | 32K | SCL | SDA | A3 | A2 | A1 | 100009672 | A0 | A6 | SS/10 | SCK/13 | MISO/12 | MOSI/11 | START/INIT | DWNLD/SET | RESET | Vcc | GND | ICSP | SGND | GND
bPlace: 100009672 | open source | http://github.com/JChristensen | CC BY-SA jc 0313 v2 | Double-A Data Logger
tNames: SOLDER | FOR 5V